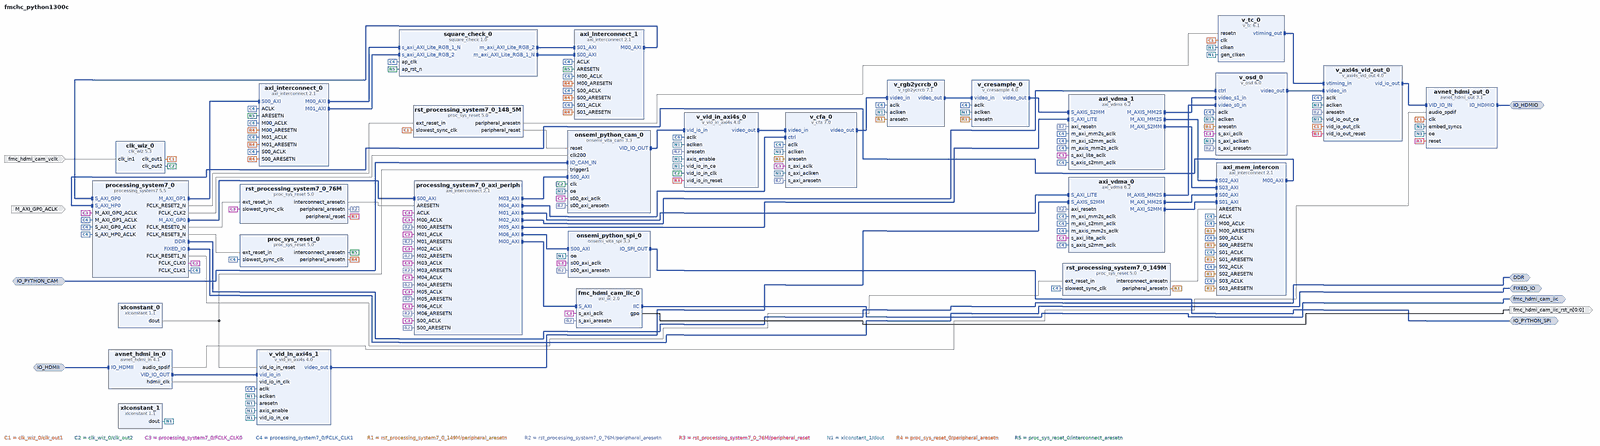
[diagram p0: block diagram of the top level, whole]
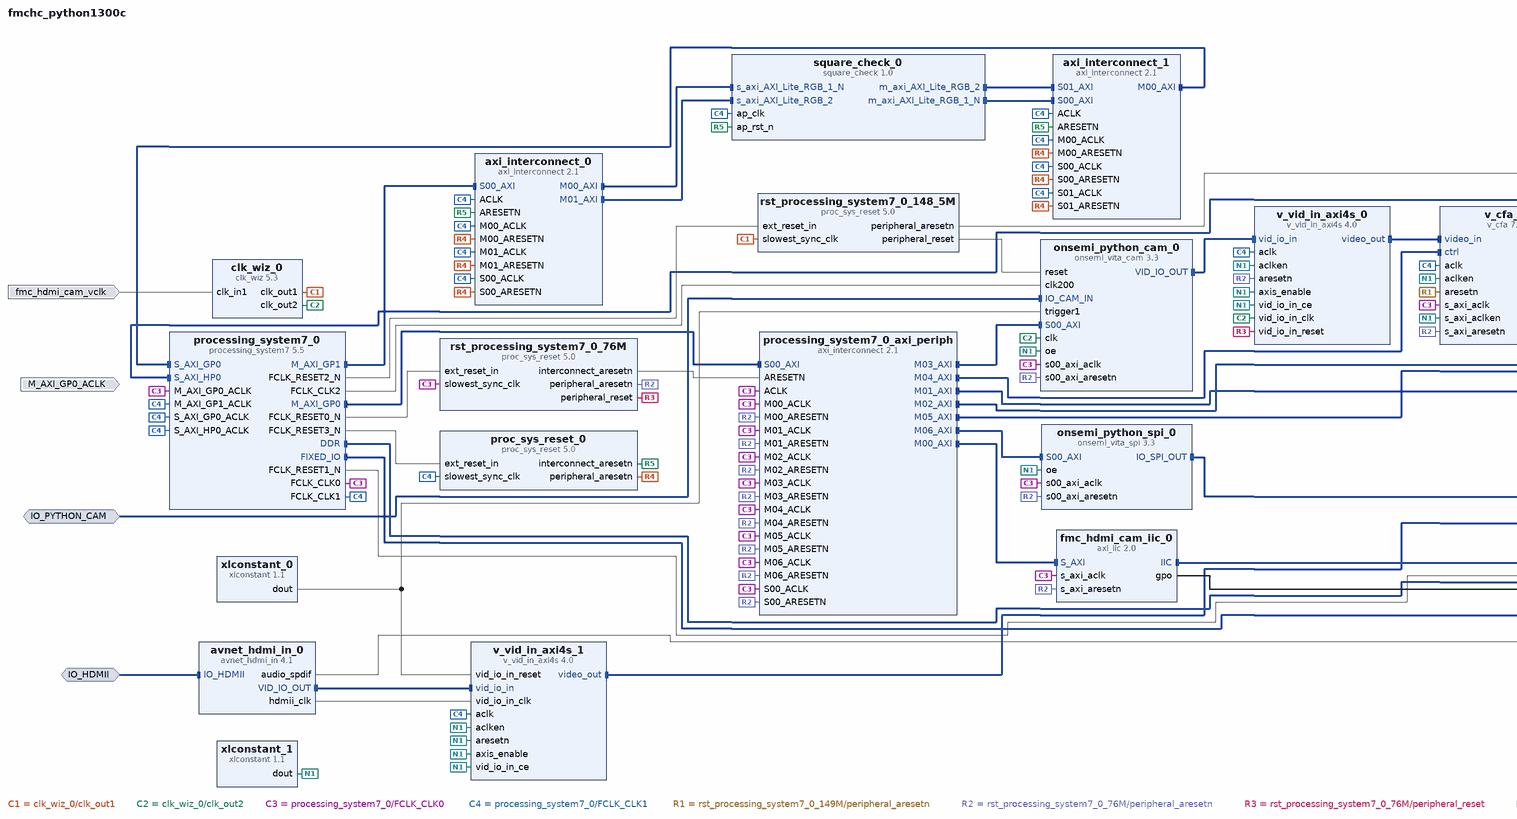
[diagram p1: block diagram of the top level, left part]
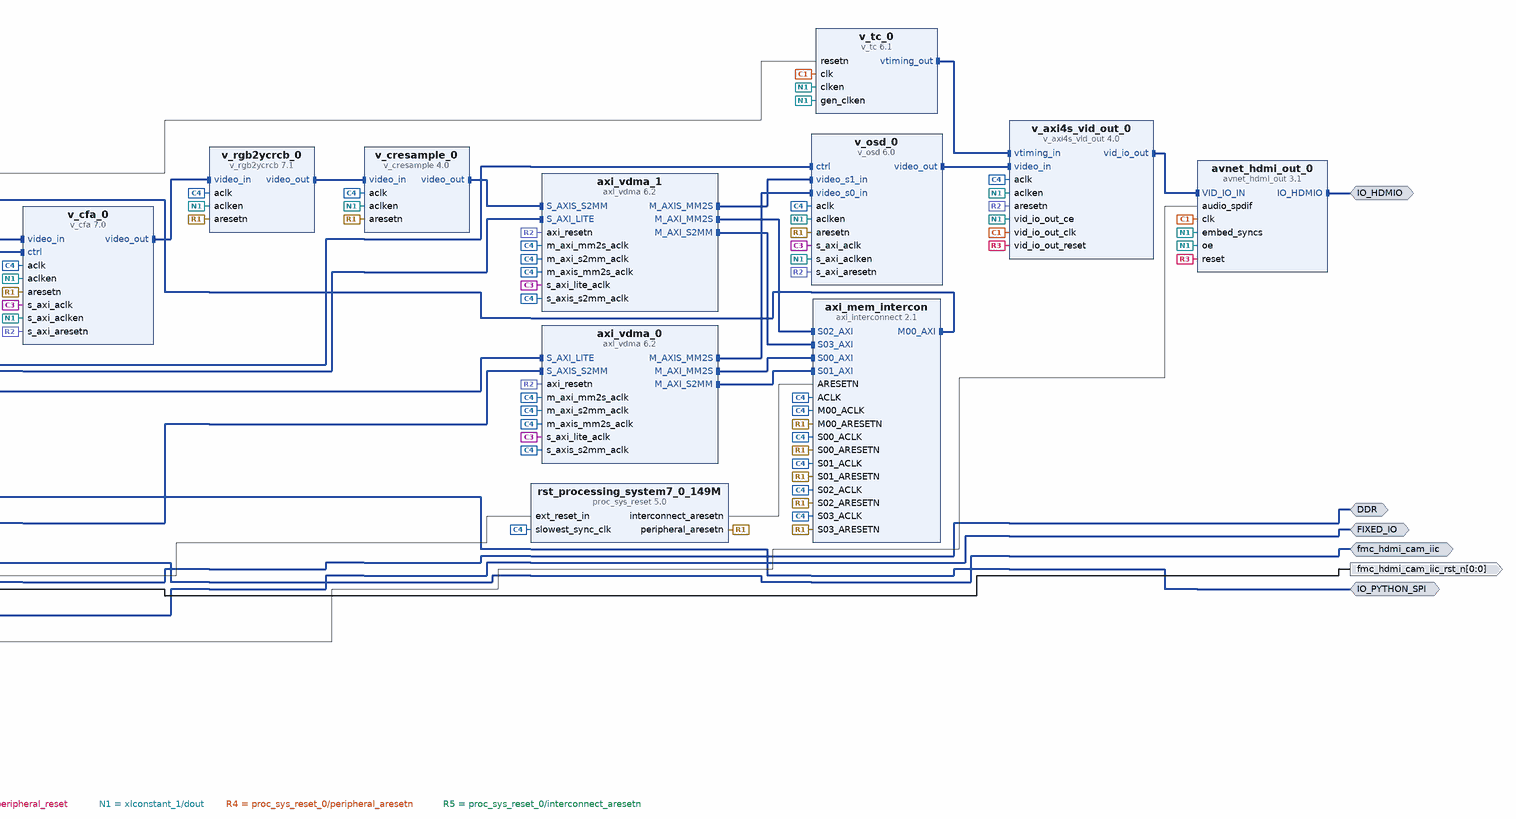
[diagram p2: block diagram of the top level, right part]
# Vivado block design fmchc_python1300c, xc7z030sbg485-1, Vivado 2016.4
create_bd_design fmchc_python1300c

create_bd_intf_port -mode Master -vlnv xilinx.com:interface:ddrx_rtl:1.0 DDR
create_bd_intf_port -mode Master -vlnv xilinx.com:display_processing_system7:fixedio_rtl:1.0 FIXED_IO
create_bd_intf_port -mode Slave -vlnv avnet.com:interface:avnet_hdmi_rtl:2.0 IO_HDMII
create_bd_intf_port -mode Master -vlnv avnet.com:interface:avnet_hdmi_rtl:2.0 IO_HDMIO
create_bd_intf_port -mode Slave -vlnv avnet.com:interface:onsemi_vita_cam_rtl:1.0 IO_PYTHON_CAM
create_bd_intf_port -mode Master -vlnv avnet.com:interface:onsemi_vita_spi_rtl:1.0 IO_PYTHON_SPI
create_bd_intf_port -mode Master -vlnv xilinx.com:interface:iic_rtl:1.0 fmc_hdmi_cam_iic
create_bd_port -dir I -type clk M_AXI_GP0_ACLK
create_bd_port -dir O -from 0 -to 0 fmc_hdmi_cam_iic_rst_n
create_bd_port -dir I fmc_hdmi_cam_vclk

create_bd_cell -type ip -vlnv xilinx.com:ip:processing_system7:5.5 processing_system7_0
set_property -dict [list \
  CONFIG.PCW_FCLK_CLK1_BUF TRUE \
  CONFIG.PCW_FCLK_CLK2_BUF TRUE \
  CONFIG.PCW_APU_PERIPHERAL_FREQMHZ 667 \
  CONFIG.PCW_SDIO_PERIPHERAL_FREQMHZ 50 \
  CONFIG.PCW_UART_PERIPHERAL_FREQMHZ 50 \
  CONFIG.PCW_FPGA0_PERIPHERAL_FREQMHZ 75 \
  CONFIG.PCW_FPGA1_PERIPHERAL_FREQMHZ 150 \
  CONFIG.PCW_FPGA2_PERIPHERAL_FREQMHZ 200 \
  CONFIG.PCW_USE_M_AXI_GP1 1 \
  CONFIG.PCW_USE_S_AXI_GP0 1 \
  CONFIG.PCW_USE_S_AXI_HP0 1 \
  CONFIG.PCW_EN_CLK1_PORT 1 \
  CONFIG.PCW_EN_CLK2_PORT 1 \
  CONFIG.PCW_EN_RST1_PORT 1 \
  CONFIG.PCW_EN_RST2_PORT 1 \
  CONFIG.PCW_EN_RST3_PORT 1 \
  CONFIG.PCW_PRESET_BANK1_VOLTAGE {LVCMOS 1.8V} \
  CONFIG.PCW_UIPARAM_DDR_MEMORY_TYPE {DDR 3 (Low Voltage)} \
  CONFIG.PCW_UIPARAM_DDR_PARTNO {MT41K256M16 RE-125} \
  CONFIG.PCW_QSPI_PERIPHERAL_ENABLE 1 \
  CONFIG.PCW_QSPI_GRP_SINGLE_SS_ENABLE 1 \
  CONFIG.PCW_QSPI_GRP_SINGLE_SS_IO {MIO 1 .. 6} \
  CONFIG.PCW_QSPI_GRP_FBCLK_ENABLE 1 \
  CONFIG.PCW_QSPI_GRP_FBCLK_IO {MIO 8} \
  CONFIG.PCW_ENET0_PERIPHERAL_ENABLE 1 \
  CONFIG.PCW_ENET0_ENET0_IO {MIO 16 .. 27} \
  CONFIG.PCW_ENET0_GRP_MDIO_ENABLE 1 \
  CONFIG.PCW_ENET0_GRP_MDIO_IO {MIO 52 .. 53} \
  CONFIG.PCW_ENET0_RESET_ENABLE 0 \
  CONFIG.PCW_SD0_PERIPHERAL_ENABLE 1 \
  CONFIG.PCW_SD0_SD0_IO {MIO 40 .. 45} \
  CONFIG.PCW_SD0_GRP_CD_ENABLE 1 \
  CONFIG.PCW_SD0_GRP_CD_IO {MIO 46} \
  CONFIG.PCW_SD0_GRP_WP_ENABLE 0 \
  CONFIG.PCW_SD1_PERIPHERAL_ENABLE 1 \
  CONFIG.PCW_SD1_SD1_IO {MIO 10 .. 15} \
  CONFIG.PCW_SD1_GRP_CD_ENABLE 1 \
  CONFIG.PCW_UART1_PERIPHERAL_ENABLE 1 \
  CONFIG.PCW_UART1_UART1_IO {MIO 48 .. 49} \
  CONFIG.PCW_TTC0_PERIPHERAL_ENABLE 1 \
  CONFIG.PCW_TTC0_TTC0_IO EMIO \
  CONFIG.PCW_USB0_PERIPHERAL_ENABLE 1 \
  CONFIG.PCW_USB0_USB0_IO {MIO 28 .. 39} \
  CONFIG.PCW_USB0_RESET_ENABLE 1 \
  CONFIG.PCW_USB0_RESET_IO {MIO 7} \
  CONFIG.PCW_I2C_RESET_ENABLE 0 \
  CONFIG.PCW_GPIO_PERIPHERAL_ENABLE 1 \
  CONFIG.PCW_GPIO_MIO_GPIO_ENABLE 1 \
] [get_bd_cells processing_system7_0]
# 157 more settings of processing_system7_0 are not shown: defaults, MIO pin electricals, DDR timing, and values the tool derives
create_bd_cell -type ip -vlnv xilinx.com:ip:v_cfa:7.0 v_cfa_0
set_property -dict [list \
  CONFIG.has_axi4_lite true \
  CONFIG.active_cols 1280 \
  CONFIG.active_rows 1024 \
  CONFIG.max_cols 1280 \
] [get_bd_cells v_cfa_0]
create_bd_cell -type ip -vlnv xilinx.com:ip:v_cresample:4.0 v_cresample_0
set_property -dict [list \
  CONFIG.active_cols 1280 \
  CONFIG.active_rows 1024 \
  CONFIG.s_axis_video_format 3 \
  CONFIG.m_axis_video_format 2 \
] [get_bd_cells v_cresample_0]
create_bd_cell -type ip -vlnv xilinx.com:ip:v_osd:6.0 v_osd_0
set_property -dict [list \
  CONFIG.NUMBER_OF_LAYERS 2 \
  CONFIG.SCREEN_WIDTH 1920 \
  CONFIG.M_AXIS_VIDEO_WIDTH 1920 \
  CONFIG.M_AXIS_VIDEO_HEIGHT 1080 \
  CONFIG.LAYER0_WIDTH 1920 \
  CONFIG.LAYER0_HEIGHT 1080 \
  CONFIG.LAYER1_WIDTH 1920 \
  CONFIG.LAYER1_HEIGHT 1080 \
] [get_bd_cells v_osd_0]
create_bd_cell -type ip -vlnv xilinx.com:ip:v_rgb2ycrcb:7.1 v_rgb2ycrcb_0
set_property -dict {CONFIG.ACTIVE_COLS 1280 CONFIG.ACTIVE_ROWS 1024} [get_bd_cells v_rgb2ycrcb_0]
create_bd_cell -type ip -vlnv xilinx.com:ip:v_tc:6.1 v_tc_0
set_property -dict {CONFIG.HAS_AXI4_LITE false CONFIG.VIDEO_MODE 1080p CONFIG.enable_detection false} [get_bd_cells v_tc_0]
create_bd_cell -type ip -vlnv avnet:avnet_hdmi:avnet_hdmi_in:4.1 avnet_hdmi_in_0
set_property -dict {CONFIG.C_USE_BUFR true} [get_bd_cells avnet_hdmi_in_0]
create_bd_cell -type ip -vlnv avnet:avnet_hdmi:avnet_hdmi_out:3.1 avnet_hdmi_out_0
set_property -dict {CONFIG.C_DEBUG_PORT false} [get_bd_cells avnet_hdmi_out_0]
create_bd_cell -type ip -vlnv xilinx.com:ip:axi_interconnect:2.1 axi_mem_intercon
set_property -dict {CONFIG.NUM_SI 4 CONFIG.NUM_MI 1} [get_bd_cells axi_mem_intercon]
create_bd_cell -type ip -vlnv xilinx.com:ip:axi_vdma:6.2 axi_vdma_0
set_property -dict [list \
  CONFIG.c_m_axis_mm2s_tdata_width 16 \
  CONFIG.c_m_axi_s2mm_data_width 64 \
  CONFIG.c_mm2s_linebuffer_depth 512 \
  CONFIG.c_s2mm_linebuffer_depth 4096 \
  CONFIG.c_mm2s_max_burst_length 256 \
  CONFIG.c_s2mm_max_burst_length 256 \
] [get_bd_cells axi_vdma_0]
create_bd_cell -type ip -vlnv xilinx.com:ip:axi_vdma:6.2 axi_vdma_1
set_property -dict [list \
  CONFIG.c_m_axis_mm2s_tdata_width 16 \
  CONFIG.c_m_axi_s2mm_data_width 64 \
  CONFIG.c_mm2s_linebuffer_depth 4096 \
  CONFIG.c_s2mm_linebuffer_depth 4096 \
  CONFIG.c_mm2s_max_burst_length 256 \
  CONFIG.c_s2mm_max_burst_length 256 \
] [get_bd_cells axi_vdma_1]
create_bd_cell -type ip -vlnv xilinx.com:ip:clk_wiz:5.3 clk_wiz_0
set_property -dict [list \
  CONFIG.PRIM_IN_FREQ 148.5 \
  CONFIG.CLKOUT2_USED true \
  CONFIG.NUM_OUT_CLKS 2 \
  CONFIG.CLKOUT1_REQUESTED_OUT_FREQ 148.5 \
  CONFIG.CLKOUT2_REQUESTED_OUT_FREQ 108 \
  CONFIG.USE_LOCKED false \
  CONFIG.USE_RESET false \
] [get_bd_cells clk_wiz_0]
create_bd_cell -type ip -vlnv xilinx.com:ip:axi_iic:2.0 fmc_hdmi_cam_iic_0
set_property -dict {CONFIG.USE_BOARD_FLOW true CONFIG.IIC_BOARD_INTERFACE Custom} [get_bd_cells fmc_hdmi_cam_iic_0]
create_bd_cell -type ip -vlnv avnet:onsemi_vita:onsemi_vita_cam:3.3 onsemi_python_cam_0
create_bd_cell -type ip -vlnv avnet:onsemi_vita:onsemi_vita_spi:3.3 onsemi_python_spi_0
create_bd_cell -type ip -vlnv xilinx.com:ip:axi_interconnect:2.1 processing_system7_0_axi_periph
set_property -dict {CONFIG.NUM_MI 7} [get_bd_cells processing_system7_0_axi_periph]
create_bd_cell -type ip -vlnv xilinx.com:ip:proc_sys_reset:5.0 rst_processing_system7_0_148_5M
create_bd_cell -type ip -vlnv xilinx.com:ip:proc_sys_reset:5.0 rst_processing_system7_0_149M
create_bd_cell -type ip -vlnv xilinx.com:ip:proc_sys_reset:5.0 rst_processing_system7_0_76M
create_bd_cell -type ip -vlnv xilinx.com:ip:v_axi4s_vid_out:4.0 v_axi4s_vid_out_0
set_property -dict {CONFIG.C_HAS_ASYNC_CLK 1 CONFIG.C_VTG_MASTER_SLAVE 1} [get_bd_cells v_axi4s_vid_out_0]
create_bd_cell -type ip -vlnv xilinx.com:ip:v_vid_in_axi4s:4.0 v_vid_in_axi4s_0
set_property -dict {CONFIG.C_M_AXIS_VIDEO_FORMAT 12 CONFIG.C_HAS_ASYNC_CLK 1} [get_bd_cells v_vid_in_axi4s_0]
create_bd_cell -type ip -vlnv xilinx.com:ip:v_vid_in_axi4s:4.0 v_vid_in_axi4s_1
set_property -dict {CONFIG.C_M_AXIS_VIDEO_FORMAT 0 CONFIG.C_HAS_ASYNC_CLK 1} [get_bd_cells v_vid_in_axi4s_1]
create_bd_cell -type ip -vlnv xilinx.com:ip:xlconstant:1.1 xlconstant_0
set_property -dict {CONFIG.CONST_VAL 0} [get_bd_cells xlconstant_0]
create_bd_cell -type ip -vlnv xilinx.com:ip:xlconstant:1.1 xlconstant_1
create_bd_cell -type ip -vlnv RUB:hls:square_check:1.0 square_check_0
create_bd_cell -type ip -vlnv xilinx.com:ip:axi_interconnect:2.1 axi_interconnect_0
create_bd_cell -type ip -vlnv xilinx.com:ip:axi_interconnect:2.1 axi_interconnect_1
set_property -dict {CONFIG.NUM_SI 2 CONFIG.NUM_MI 1} [get_bd_cells axi_interconnect_1]
create_bd_cell -type ip -vlnv xilinx.com:ip:proc_sys_reset:5.0 proc_sys_reset_0

# ---- connections ----

connect_bd_intf_net [get_bd_intf_pins avnet_hdmi_in_0/VID_IO_OUT] [get_bd_intf_pins v_vid_in_axi4s_1/vid_io_in]
connect_bd_intf_net [get_bd_intf_pins axi_mem_intercon/M00_AXI] [get_bd_intf_pins processing_system7_0/S_AXI_HP0]
connect_bd_intf_net [get_bd_intf_pins axi_vdma_0/M_AXIS_MM2S] [get_bd_intf_pins v_osd_0/video_s0_in]
connect_bd_intf_net [get_bd_intf_pins axi_mem_intercon/S00_AXI] [get_bd_intf_pins axi_vdma_0/M_AXI_MM2S]
connect_bd_intf_net [get_bd_intf_pins axi_mem_intercon/S01_AXI] [get_bd_intf_pins axi_vdma_0/M_AXI_S2MM]
connect_bd_intf_net [get_bd_intf_pins axi_vdma_1/M_AXIS_MM2S] [get_bd_intf_pins v_osd_0/video_s1_in]
connect_bd_intf_net [get_bd_intf_pins axi_mem_intercon/S02_AXI] [get_bd_intf_pins axi_vdma_1/M_AXI_MM2S]
connect_bd_intf_net [get_bd_intf_pins axi_mem_intercon/S03_AXI] [get_bd_intf_pins axi_vdma_1/M_AXI_S2MM]
connect_bd_intf_net [get_bd_intf_pins onsemi_python_cam_0/VID_IO_OUT] [get_bd_intf_pins v_vid_in_axi4s_0/vid_io_in]
connect_bd_intf_net [get_bd_intf_pins processing_system7_0/M_AXI_GP0] [get_bd_intf_pins processing_system7_0_axi_periph/S00_AXI]
connect_bd_intf_net [get_bd_intf_pins fmc_hdmi_cam_iic_0/S_AXI] [get_bd_intf_pins processing_system7_0_axi_periph/M00_AXI]
connect_bd_intf_net [get_bd_intf_pins axi_vdma_0/S_AXI_LITE] [get_bd_intf_pins processing_system7_0_axi_periph/M01_AXI]
connect_bd_intf_net [get_bd_intf_pins processing_system7_0_axi_periph/M02_AXI] [get_bd_intf_pins v_osd_0/ctrl]
connect_bd_intf_net [get_bd_intf_pins onsemi_python_cam_0/S00_AXI] [get_bd_intf_pins processing_system7_0_axi_periph/M03_AXI]
connect_bd_intf_net [get_bd_intf_pins processing_system7_0_axi_periph/M04_AXI] [get_bd_intf_pins v_cfa_0/ctrl]
connect_bd_intf_net [get_bd_intf_pins axi_vdma_1/S_AXI_LITE] [get_bd_intf_pins processing_system7_0_axi_periph/M05_AXI]
connect_bd_intf_net [get_bd_intf_pins onsemi_python_spi_0/S00_AXI] [get_bd_intf_pins processing_system7_0_axi_periph/M06_AXI]
connect_bd_intf_net [get_bd_intf_pins avnet_hdmi_out_0/VID_IO_IN] [get_bd_intf_pins v_axi4s_vid_out_0/vid_io_out]
connect_bd_intf_net [get_bd_intf_pins v_cfa_0/video_out] [get_bd_intf_pins v_rgb2ycrcb_0/video_in]
connect_bd_intf_net [get_bd_intf_pins axi_vdma_1/S_AXIS_S2MM] [get_bd_intf_pins v_cresample_0/video_out]
connect_bd_intf_net [get_bd_intf_pins v_axi4s_vid_out_0/video_in] [get_bd_intf_pins v_osd_0/video_out]
connect_bd_intf_net [get_bd_intf_pins v_cresample_0/video_in] [get_bd_intf_pins v_rgb2ycrcb_0/video_out]
connect_bd_intf_net [get_bd_intf_pins v_axi4s_vid_out_0/vtiming_in] [get_bd_intf_pins v_tc_0/vtiming_out]
connect_bd_intf_net [get_bd_intf_pins v_cfa_0/video_in] [get_bd_intf_pins v_vid_in_axi4s_0/video_out]
connect_bd_intf_net [get_bd_intf_pins axi_vdma_0/S_AXIS_S2MM] [get_bd_intf_pins v_vid_in_axi4s_1/video_out]
connect_bd_intf_net [get_bd_intf_pins axi_interconnect_0/M00_AXI] [get_bd_intf_pins square_check_0/s_axi_AXI_Lite_RGB_1_N]
connect_bd_intf_net [get_bd_intf_pins axi_interconnect_0/M01_AXI] [get_bd_intf_pins square_check_0/s_axi_AXI_Lite_RGB_2]
connect_bd_intf_net [get_bd_intf_pins axi_interconnect_1/S01_AXI] [get_bd_intf_pins square_check_0/m_axi_AXI_Lite_RGB_2]
connect_bd_intf_net [get_bd_intf_pins axi_interconnect_1/S00_AXI] [get_bd_intf_pins square_check_0/m_axi_AXI_Lite_RGB_1_N]
connect_bd_intf_net [get_bd_intf_pins processing_system7_0/S_AXI_GP0] [get_bd_intf_pins axi_interconnect_1/M00_AXI]
connect_bd_intf_net [get_bd_intf_pins processing_system7_0/M_AXI_GP1] [get_bd_intf_pins axi_interconnect_0/S00_AXI]
connect_bd_intf_net [get_bd_intf_ports DDR] [get_bd_intf_pins processing_system7_0/DDR]
connect_bd_intf_net [get_bd_intf_ports FIXED_IO] [get_bd_intf_pins processing_system7_0/FIXED_IO]
connect_bd_intf_net [get_bd_intf_ports IO_HDMII] [get_bd_intf_pins avnet_hdmi_in_0/IO_HDMII]
connect_bd_intf_net [get_bd_intf_ports IO_HDMIO] [get_bd_intf_pins avnet_hdmi_out_0/IO_HDMIO]
connect_bd_intf_net [get_bd_intf_ports IO_PYTHON_CAM] [get_bd_intf_pins onsemi_python_cam_0/IO_CAM_IN]
connect_bd_intf_net [get_bd_intf_ports IO_PYTHON_SPI] [get_bd_intf_pins onsemi_python_spi_0/IO_SPI_OUT]
connect_bd_intf_net [get_bd_intf_ports fmc_hdmi_cam_iic] [get_bd_intf_pins fmc_hdmi_cam_iic_0/IIC]
# net M_AXI_GP0_ACLK_1 has one end: M_AXI_GP0_ACLK
connect_bd_net [get_bd_pins avnet_hdmi_in_0/audio_spdif] [get_bd_pins avnet_hdmi_out_0/audio_spdif]
connect_bd_net [get_bd_pins avnet_hdmi_in_0/hdmii_clk] [get_bd_pins v_vid_in_axi4s_1/vid_io_in_clk]
connect_bd_net [get_bd_pins clk_wiz_0/clk_out1] \
  [get_bd_pins avnet_hdmi_out_0/clk] [get_bd_pins rst_processing_system7_0_148_5M/slowest_sync_clk] \
  [get_bd_pins v_axi4s_vid_out_0/vid_io_out_clk] [get_bd_pins v_tc_0/clk]
connect_bd_net [get_bd_pins clk_wiz_0/clk_out2] [get_bd_pins onsemi_python_cam_0/clk] [get_bd_pins v_vid_in_axi4s_0/vid_io_in_clk]
connect_bd_net [get_bd_pins fmc_hdmi_cam_iic_0/gpo] [get_bd_ports fmc_hdmi_cam_iic_rst_n]
connect_bd_net [get_bd_ports fmc_hdmi_cam_vclk] [get_bd_pins clk_wiz_0/clk_in1]
connect_bd_net [get_bd_pins processing_system7_0/FCLK_CLK0] \
  [get_bd_pins axi_vdma_0/s_axi_lite_aclk] [get_bd_pins axi_vdma_1/s_axi_lite_aclk] \
  [get_bd_pins fmc_hdmi_cam_iic_0/s_axi_aclk] [get_bd_pins onsemi_python_cam_0/s00_axi_aclk] \
  [get_bd_pins onsemi_python_spi_0/s00_axi_aclk] [get_bd_pins processing_system7_0/M_AXI_GP0_ACLK] \
  [get_bd_pins rst_processing_system7_0_76M/slowest_sync_clk] [get_bd_pins v_cfa_0/s_axi_aclk] \
  [get_bd_pins v_osd_0/s_axi_aclk] [get_bd_pins processing_system7_0_axi_periph/ACLK] \
  [get_bd_pins processing_system7_0_axi_periph/M00_ACLK] [get_bd_pins processing_system7_0_axi_periph/M01_ACLK] \
  [get_bd_pins processing_system7_0_axi_periph/M02_ACLK] [get_bd_pins processing_system7_0_axi_periph/M03_ACLK] \
  [get_bd_pins processing_system7_0_axi_periph/M04_ACLK] [get_bd_pins processing_system7_0_axi_periph/M05_ACLK] \
  [get_bd_pins processing_system7_0_axi_periph/M06_ACLK] [get_bd_pins processing_system7_0_axi_periph/S00_ACLK]
connect_bd_net [get_bd_pins processing_system7_0/FCLK_CLK1] \
  [get_bd_pins axi_vdma_0/m_axi_mm2s_aclk] [get_bd_pins axi_vdma_0/m_axi_s2mm_aclk] [get_bd_pins axi_vdma_0/m_axis_mm2s_aclk] \
  [get_bd_pins axi_vdma_0/s_axis_s2mm_aclk] [get_bd_pins axi_vdma_1/m_axi_mm2s_aclk] [get_bd_pins axi_vdma_1/m_axi_s2mm_aclk] \
  [get_bd_pins axi_vdma_1/m_axis_mm2s_aclk] [get_bd_pins axi_vdma_1/s_axis_s2mm_aclk] \
  [get_bd_pins processing_system7_0/S_AXI_HP0_ACLK] [get_bd_pins rst_processing_system7_0_149M/slowest_sync_clk] \
  [get_bd_pins v_axi4s_vid_out_0/aclk] [get_bd_pins v_cfa_0/aclk] [get_bd_pins v_cresample_0/aclk] [get_bd_pins v_osd_0/aclk] \
  [get_bd_pins v_rgb2ycrcb_0/aclk] [get_bd_pins v_vid_in_axi4s_0/aclk] [get_bd_pins v_vid_in_axi4s_1/aclk] \
  [get_bd_pins processing_system7_0/M_AXI_GP1_ACLK] [get_bd_pins processing_system7_0/S_AXI_GP0_ACLK] \
  [get_bd_pins proc_sys_reset_0/slowest_sync_clk] [get_bd_pins square_check_0/ap_clk] [get_bd_pins axi_mem_intercon/ACLK] \
  [get_bd_pins axi_mem_intercon/M00_ACLK] [get_bd_pins axi_mem_intercon/S00_ACLK] [get_bd_pins axi_mem_intercon/S01_ACLK] \
  [get_bd_pins axi_mem_intercon/S02_ACLK] [get_bd_pins axi_mem_intercon/S03_ACLK] [get_bd_pins axi_interconnect_1/S01_ACLK] \
  [get_bd_pins axi_interconnect_1/M00_ACLK] [get_bd_pins axi_interconnect_1/S00_ACLK] [get_bd_pins axi_interconnect_1/ACLK] \
  [get_bd_pins axi_interconnect_0/ACLK] [get_bd_pins axi_interconnect_0/S00_ACLK] [get_bd_pins axi_interconnect_0/M00_ACLK] \
  [get_bd_pins axi_interconnect_0/M01_ACLK]
connect_bd_net [get_bd_pins processing_system7_0/FCLK_CLK2] [get_bd_pins onsemi_python_cam_0/clk200]
connect_bd_net [get_bd_pins processing_system7_0/FCLK_RESET0_N] [get_bd_pins rst_processing_system7_0_76M/ext_reset_in]
connect_bd_net [get_bd_pins processing_system7_0/FCLK_RESET1_N] [get_bd_pins rst_processing_system7_0_149M/ext_reset_in]
connect_bd_net [get_bd_pins processing_system7_0/FCLK_RESET2_N] [get_bd_pins rst_processing_system7_0_148_5M/ext_reset_in]
connect_bd_net [get_bd_pins rst_processing_system7_0_148_5M/peripheral_aresetn] [get_bd_pins v_tc_0/resetn]
connect_bd_net [get_bd_pins rst_processing_system7_0_148_5M/peripheral_reset] [get_bd_pins onsemi_python_cam_0/reset]
connect_bd_net [get_bd_pins rst_processing_system7_0_149M/interconnect_aresetn] [get_bd_pins axi_mem_intercon/ARESETN]
connect_bd_net [get_bd_pins rst_processing_system7_0_149M/peripheral_aresetn] \
  [get_bd_pins v_cfa_0/aresetn] [get_bd_pins v_cresample_0/aresetn] [get_bd_pins v_osd_0/aresetn] \
  [get_bd_pins v_rgb2ycrcb_0/aresetn] [get_bd_pins axi_mem_intercon/M00_ARESETN] [get_bd_pins axi_mem_intercon/S00_ARESETN] \
  [get_bd_pins axi_mem_intercon/S01_ARESETN] [get_bd_pins axi_mem_intercon/S02_ARESETN] \
  [get_bd_pins axi_mem_intercon/S03_ARESETN]
connect_bd_net [get_bd_pins rst_processing_system7_0_76M/interconnect_aresetn] [get_bd_pins processing_system7_0_axi_periph/ARESETN]
connect_bd_net [get_bd_pins rst_processing_system7_0_76M/peripheral_aresetn] \
  [get_bd_pins axi_vdma_0/axi_resetn] [get_bd_pins axi_vdma_1/axi_resetn] [get_bd_pins fmc_hdmi_cam_iic_0/s_axi_aresetn] \
  [get_bd_pins onsemi_python_cam_0/s00_axi_aresetn] [get_bd_pins onsemi_python_spi_0/s00_axi_aresetn] \
  [get_bd_pins v_axi4s_vid_out_0/aresetn] [get_bd_pins v_cfa_0/s_axi_aresetn] [get_bd_pins v_osd_0/s_axi_aresetn] \
  [get_bd_pins v_vid_in_axi4s_0/aresetn] [get_bd_pins processing_system7_0_axi_periph/M00_ARESETN] \
  [get_bd_pins processing_system7_0_axi_periph/M01_ARESETN] [get_bd_pins processing_system7_0_axi_periph/M02_ARESETN] \
  [get_bd_pins processing_system7_0_axi_periph/M03_ARESETN] [get_bd_pins processing_system7_0_axi_periph/M04_ARESETN] \
  [get_bd_pins processing_system7_0_axi_periph/M05_ARESETN] [get_bd_pins processing_system7_0_axi_periph/M06_ARESETN] \
  [get_bd_pins processing_system7_0_axi_periph/S00_ARESETN]
connect_bd_net [get_bd_pins rst_processing_system7_0_76M/peripheral_reset] \
  [get_bd_pins avnet_hdmi_out_0/reset] [get_bd_pins v_axi4s_vid_out_0/vid_io_out_reset] \
  [get_bd_pins v_vid_in_axi4s_0/vid_io_in_reset]
connect_bd_net [get_bd_pins xlconstant_0/dout] [get_bd_pins onsemi_python_cam_0/trigger1] [get_bd_pins v_vid_in_axi4s_1/vid_io_in_reset]
connect_bd_net [get_bd_pins xlconstant_1/dout] \
  [get_bd_pins avnet_hdmi_out_0/embed_syncs] [get_bd_pins avnet_hdmi_out_0/oe] [get_bd_pins onsemi_python_cam_0/oe] \
  [get_bd_pins onsemi_python_spi_0/oe] [get_bd_pins v_axi4s_vid_out_0/aclken] [get_bd_pins v_axi4s_vid_out_0/vid_io_out_ce] \
  [get_bd_pins v_cfa_0/aclken] [get_bd_pins v_cfa_0/s_axi_aclken] [get_bd_pins v_cresample_0/aclken] \
  [get_bd_pins v_osd_0/aclken] [get_bd_pins v_osd_0/s_axi_aclken] [get_bd_pins v_rgb2ycrcb_0/aclken] \
  [get_bd_pins v_tc_0/clken] [get_bd_pins v_tc_0/gen_clken] [get_bd_pins v_vid_in_axi4s_0/aclken] \
  [get_bd_pins v_vid_in_axi4s_0/axis_enable] [get_bd_pins v_vid_in_axi4s_0/vid_io_in_ce] \
  [get_bd_pins v_vid_in_axi4s_1/aclken] [get_bd_pins v_vid_in_axi4s_1/aresetn] [get_bd_pins v_vid_in_axi4s_1/axis_enable] \
  [get_bd_pins v_vid_in_axi4s_1/vid_io_in_ce]
connect_bd_net [get_bd_pins proc_sys_reset_0/peripheral_aresetn] \
  [get_bd_pins axi_interconnect_1/S01_ARESETN] [get_bd_pins axi_interconnect_1/M00_ARESETN] \
  [get_bd_pins axi_interconnect_1/S00_ARESETN] [get_bd_pins axi_interconnect_0/M01_ARESETN] \
  [get_bd_pins axi_interconnect_0/M00_ARESETN] [get_bd_pins axi_interconnect_0/S00_ARESETN]
connect_bd_net [get_bd_pins proc_sys_reset_0/interconnect_aresetn] \
  [get_bd_pins square_check_0/ap_rst_n] [get_bd_pins axi_interconnect_0/ARESETN] [get_bd_pins axi_interconnect_1/ARESETN]
connect_bd_net [get_bd_pins processing_system7_0/FCLK_RESET3_N] [get_bd_pins proc_sys_reset_0/ext_reset_in]

# ---- address map ----
assign_bd_address -offset 0x00000000 -range 512M -target_address_space [get_bd_addr_spaces axi_vdma_0/Data_MM2S] [get_bd_addr_segs processing_system7_0/S_AXI_HP0/HP0_DDR_LOWOCM]
assign_bd_address -offset 0x00000000 -range 512M -target_address_space [get_bd_addr_spaces axi_vdma_0/Data_S2MM] [get_bd_addr_segs processing_system7_0/S_AXI_HP0/HP0_DDR_LOWOCM]
assign_bd_address -offset 0x00000000 -range 512M -target_address_space [get_bd_addr_spaces axi_vdma_1/Data_MM2S] [get_bd_addr_segs processing_system7_0/S_AXI_HP0/HP0_DDR_LOWOCM]
assign_bd_address -offset 0x00000000 -range 512M -target_address_space [get_bd_addr_spaces axi_vdma_1/Data_S2MM] [get_bd_addr_segs processing_system7_0/S_AXI_HP0/HP0_DDR_LOWOCM]
assign_bd_address -offset 0x41600000 -range 64K -target_address_space [get_bd_addr_spaces processing_system7_0/Data] [get_bd_addr_segs fmc_hdmi_cam_iic_0/S_AXI/Reg]
assign_bd_address -offset 0x43000000 -range 64K -target_address_space [get_bd_addr_spaces processing_system7_0/Data] [get_bd_addr_segs axi_vdma_0/S_AXI_LITE/Reg]
assign_bd_address -offset 0x43010000 -range 64K -target_address_space [get_bd_addr_spaces processing_system7_0/Data] [get_bd_addr_segs axi_vdma_1/S_AXI_LITE/Reg]
assign_bd_address -offset 0x43C10000 -range 64K -target_address_space [get_bd_addr_spaces processing_system7_0/Data] [get_bd_addr_segs v_osd_0/ctrl/Reg]
assign_bd_address -offset 0x43C20000 -range 64K -target_address_space [get_bd_addr_spaces processing_system7_0/Data] [get_bd_addr_segs onsemi_python_cam_0/S00_AXI/Reg]
assign_bd_address -offset 0x43C30000 -range 64K -target_address_space [get_bd_addr_spaces processing_system7_0/Data] [get_bd_addr_segs v_cfa_0/ctrl/Reg]
assign_bd_address -offset 0x43C40000 -range 64K -target_address_space [get_bd_addr_spaces processing_system7_0/Data] [get_bd_addr_segs onsemi_python_spi_0/S00_AXI/Reg]
assign_bd_address -offset 0x83C00000 -range 64K -target_address_space [get_bd_addr_spaces processing_system7_0/Data] [get_bd_addr_segs square_check_0/s_axi_AXI_Lite_RGB_1_N/Reg]
assign_bd_address -offset 0x83C10000 -range 64K -target_address_space [get_bd_addr_spaces processing_system7_0/Data] [get_bd_addr_segs square_check_0/s_axi_AXI_Lite_RGB_2/Reg]
assign_bd_address -offset 0x00000000 -range 1G -target_address_space [get_bd_addr_spaces square_check_0/Data_m_axi_AXI_Lite_RGB_1_N] [get_bd_addr_segs processing_system7_0/S_AXI_GP0/GP0_DDR_LOWOCM]
assign_bd_address -offset 0x40000000 -range 1G -target_address_space [get_bd_addr_spaces square_check_0/Data_m_axi_AXI_Lite_RGB_1_N] [get_bd_addr_segs processing_system7_0/S_AXI_GP0/GP0_M_AXI_GP0]
assign_bd_address -offset 0x80000000 -range 1G -target_address_space [get_bd_addr_spaces square_check_0/Data_m_axi_AXI_Lite_RGB_1_N] [get_bd_addr_segs processing_system7_0/S_AXI_GP0/GP0_M_AXI_GP1]
assign_bd_address -offset 0xE0000000 -range 4M -target_address_space [get_bd_addr_spaces square_check_0/Data_m_axi_AXI_Lite_RGB_1_N] [get_bd_addr_segs processing_system7_0/S_AXI_GP0/GP0_IOP]
assign_bd_address -offset 0xFC000000 -range 16M -target_address_space [get_bd_addr_spaces square_check_0/Data_m_axi_AXI_Lite_RGB_1_N] [get_bd_addr_segs processing_system7_0/S_AXI_GP0/GP0_QSPI_LINEAR]
assign_bd_address -offset 0x00000000 -range 1G -target_address_space [get_bd_addr_spaces square_check_0/Data_m_axi_AXI_Lite_RGB_2] [get_bd_addr_segs processing_system7_0/S_AXI_GP0/GP0_DDR_LOWOCM]
assign_bd_address -offset 0x40000000 -range 1G -target_address_space [get_bd_addr_spaces square_check_0/Data_m_axi_AXI_Lite_RGB_2] [get_bd_addr_segs processing_system7_0/S_AXI_GP0/GP0_M_AXI_GP0]
assign_bd_address -offset 0x80000000 -range 1G -target_address_space [get_bd_addr_spaces square_check_0/Data_m_axi_AXI_Lite_RGB_2] [get_bd_addr_segs processing_system7_0/S_AXI_GP0/GP0_M_AXI_GP1]
assign_bd_address -offset 0xE0000000 -range 4M -target_address_space [get_bd_addr_spaces square_check_0/Data_m_axi_AXI_Lite_RGB_2] [get_bd_addr_segs processing_system7_0/S_AXI_GP0/GP0_IOP]
assign_bd_address -offset 0xFC000000 -range 16M -target_address_space [get_bd_addr_spaces square_check_0/Data_m_axi_AXI_Lite_RGB_2] [get_bd_addr_segs processing_system7_0/S_AXI_GP0/GP0_QSPI_LINEAR]

validate_bd_design
save_bd_design
